# Altium project BMS.PrjPcb
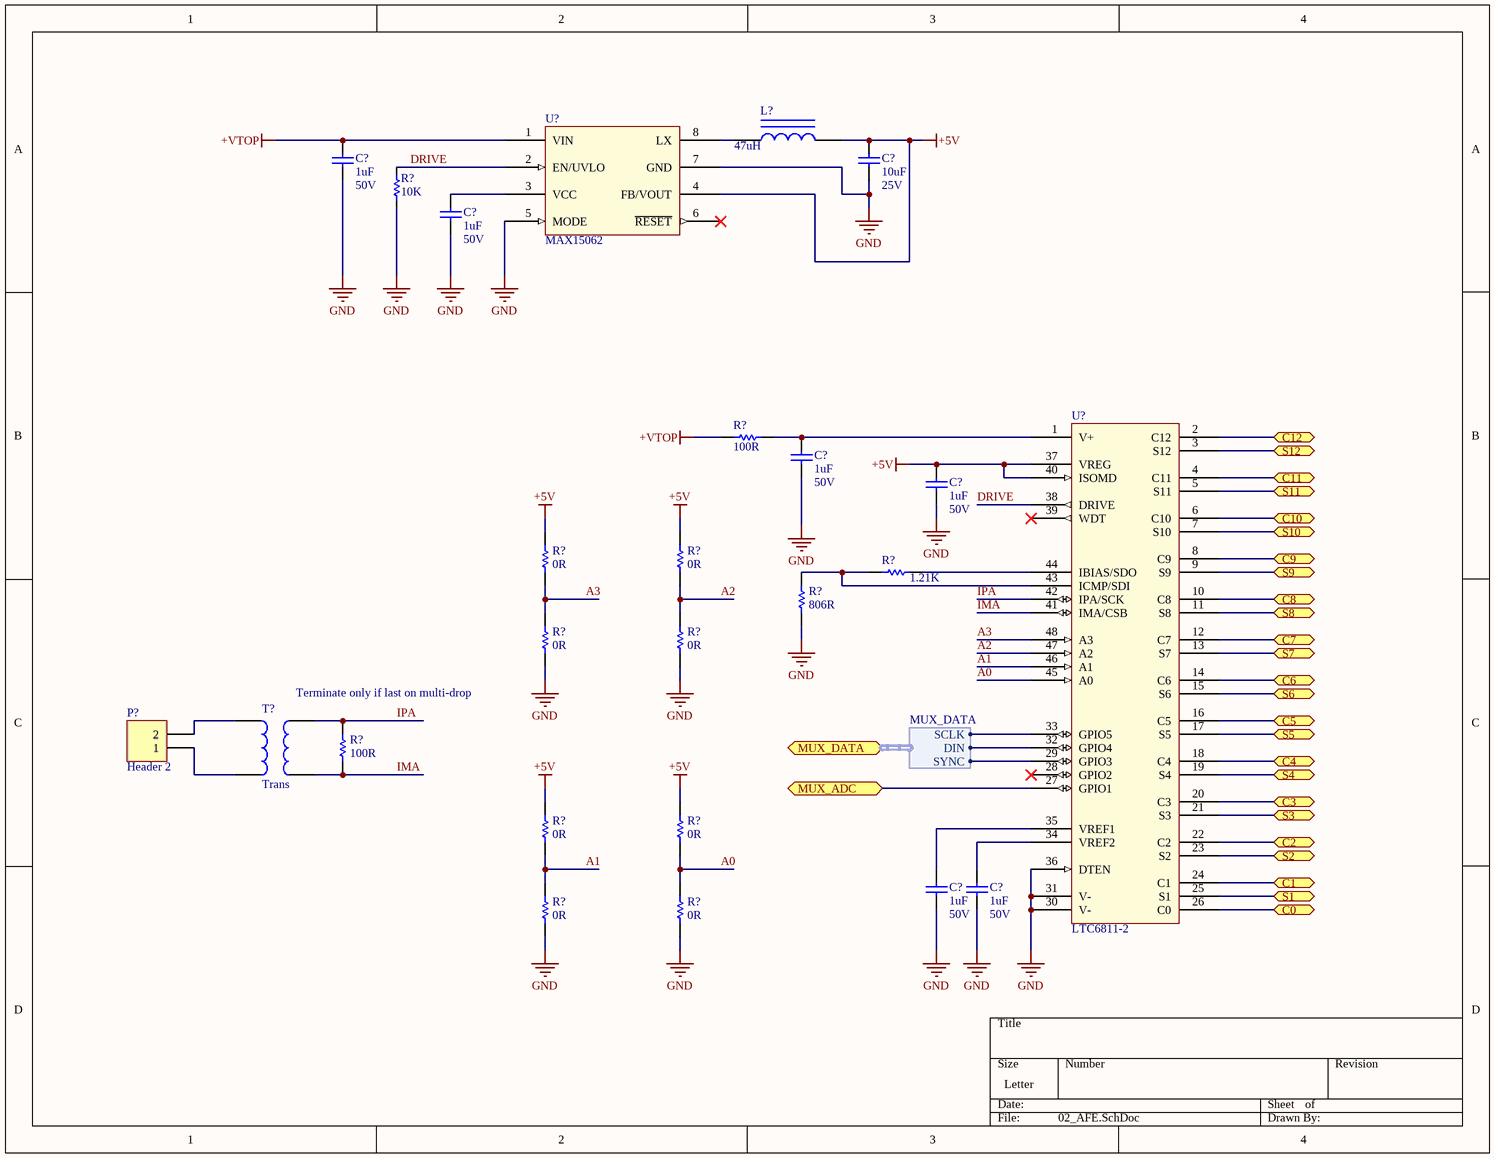
[diagram p0: 02_AFE.SchDoc]
3 sheets, 36 parts. Net scope: flat (ports and power ports of the same name join across sheets).
Sheets:
  01_BlockDiagram.SchDoc
  02_AFE.SchDoc
  04_ThermistorConnection.SchDoc

## Sheet 01_BlockDiagram.SchDoc
size Letter

## Sheet 02_AFE.SchDoc
size Letter

### Parts
(Parts that share a designator on the sheet are numbered #1, #2 ... from top to bottom, then left to right.)
C?#1  1uF  Voltage: 50V  [CAPC1608X06N]
C?#2  10uF  Voltage: 25V  [CAPC1608X06N]
C?#3  1uF  Voltage: 50V  [CAPC1608X06N]
C?#4  1uF  Voltage: 50V  [CAPC1608X06N]
C?#5  1uF  Voltage: 50V  [CAPC1608X06N]
C?#6  1uF  Voltage: 50V  [CAPC1608X06N]
C?#7  1uF  Voltage: 50V  [CAPC1608X06N]
L?  value 47uH  [AXIAL-0.9]  (hidden comment: nductor Iron)
P?  Header 2  [HDR1X2]
R?#1  10K  [0805]
R?#2  value 100R  [AXIAL-0.3]  (hidden comment: Res1)
R?#3  value 0R  [AXIAL-0.3]  (hidden comment: Res1)
R?#4  value 0R  [AXIAL-0.3]  (hidden comment: Res1)
R?#5  value 1.21K  [AXIAL-0.3]  (hidden comment: Res1)
R?#6  value 806R  [AXIAL-0.3]  (hidden comment: Res1)
R?#7  value 0R  [AXIAL-0.3]  (hidden comment: Res1)
R?#8  value 0R  [AXIAL-0.3]  (hidden comment: Res1)
R?#9  value 100R  [AXIAL-0.3]  (hidden comment: Res1)
R?#10  value 0R  [AXIAL-0.3]  (hidden comment: Res1)
R?#11  value 0R  [AXIAL-0.3]  (hidden comment: Res1)
R?#12  value 0R  [AXIAL-0.3]  (hidden comment: Res1)
R?#13  value 0R  [AXIAL-0.3]  (hidden comment: Res1)
T?  Trans  [TRANS]
U?#1  MAX15062
U?#2  LTC6811-2

### Ports
C0, C1, C2, C3, C4, C5, C6, C7, C8, C9, C10, C11, C12, MUX_ADC, MUX_DATA (harness MUX_DATA), S1, S2, S3, S4, S5, S6, S7, S8, S9, S10, S11, S12

### Harnesses
MUX_DATA: SYNC, DIN, SCLK

### Nets
+5V: C?#2.2 C?#5.2 L?.2 R?#3.2 R?#4.2 R?#10.2 R?#11.2 U?#1.4(FB/VOUT) U?#2.37(VREG) U?#2.40(ISOMD)
+VTOP: C?#1.2 R?#2.2 U?#1.1(VIN)
GND: C?#1.1 C?#2.1 C?#3.1 C?#4.1 C?#5.1 C?#6.1 C?#7.1 R?#1.1 R?#6.1 R?#7.1 R?#8.1 R?#12.1 R?#13.1 U?#1.5(MODE) U?#1.7(GND) U?#2.30(V-) U?#2.31(V-) U?#2.36(DTEN)
A0: R?#11.1 R?#13.2 U?#2.45(A0)
A1: R?#10.1 R?#12.2 U?#2.46(A1)
A2: R?#4.1 R?#8.2 U?#2.47(A2)
A3: R?#3.1 R?#7.2 U?#2.48(A3)
DRIVE: R?#1.2 U?#1.2(EN/UVLO) U?#2.38(DRIVE)
IMA: R?#9.1 T?.4 U?#2.41(IMA/CSB)
IPA: R?#9.2 T?.3 U?#2.42(IPA/SCK)
NetC?#3_2: C?#3.2 U?#1.3(VCC)
NetC?#4_2: C?#4.2 R?#2.1 U?#2.1(V+)
NetC?#6_2: C?#6.2 U?#2.35(VREF1)
NetC?#7_2: C?#7.2 U?#2.34(VREF2)
NetC?#11_2: U?#2.27(GPIO1) ; port MUX_ADC
NetL?_1: L?.1 U?#1.8(LX)
NetP?_1: P?.1 T?.2
NetP?_2: P?.2 T?.1
NetR?#5_1: R?#5.1 U?#2.44(IBIAS/SDO)
NetR?#5_2: R?#5.2 R?#6.2 U?#2.43(ICMP/SDI)
NetU?#2_2: U?#2.2(C12) ; port C12
NetU?#2_3: U?#2.3(S12) ; port S12
NetU?#2_4: U?#2.4(C11) ; port C11
NetU?#2_5: U?#2.5(S11) ; port S11
NetU?#2_6: U?#2.6(C10) ; port C10
NetU?#2_7: U?#2.7(S10) ; port S10
NetU?#2_8: U?#2.8(C9) ; port C9
NetU?#2_9: U?#2.9(S9) ; port S9
NetU?#2_10: U?#2.10(C8) ; port C8
NetU?#2_11: U?#2.11(S8) ; port S8
NetU?#2_12: U?#2.12(C7) ; port C7
NetU?#2_13: U?#2.13(S7) ; port S7
NetU?#2_14: U?#2.14(C6) ; port C6
NetU?#2_15: U?#2.15(S6) ; port S6
NetU?#2_16: U?#2.16(C5) ; port C5
NetU?#2_17: U?#2.17(S5) ; port S5
NetU?#2_18: U?#2.18(C4) ; port C4
NetU?#2_19: U?#2.19(S4) ; port S4
NetU?#2_20: U?#2.20(C3) ; port C3
NetU?#2_21: U?#2.21(S3) ; port S3
NetU?#2_22: U?#2.22(C2) ; port C2
NetU?#2_23: U?#2.23(S2) ; port S2
NetU?#2_24: U?#2.24(C1) ; port C1
NetU?#2_25: U?#2.25(S1) ; port S1
NetU?#2_26: U?#2.26(C0) ; port C0
NetU?#2_29: U?#2.29(GPIO3) ; port MUX_DATA.SYNC
NetU?#2_32: U?#2.32(GPIO4) ; port MUX_DATA.DIN
NetU?#2_33: U?#2.33(GPIO5) ; port MUX_DATA.SCLK

Not connected (* = marked no-connect by the designer): U?#1 6(~{RESET})*; U?#2 28(GPIO2)* 39(WDT)*

### Notes on the sheet
- Terminate only if last on multi-drop

### Library data of the parts
C?#1 C?#3-C?#7 = CAP CER 1UF 50V 10% X7R 0603: 1µF ±10% 50V Ceramic Capacitor X7R 0603 (1608 Metric); Manufacturer: Taiyo Yuden; ManufacturerPartNumber: UMK107AB7105KA-T; Value: 1uF; Supplier 1: Digi-Key; Supplier Part Number 1: 587-3247-1-ND
C?#2 = CAP CER 10uF 25V 20% X5R 0603: 10µF ±20% 25V Ceramic Capacitor X5R 0603 (1608 Metric); Manufacturer: Murata Electronics North America; ManufacturerPartNumber: GRM188R61E106MA73D; Value: 10uF; Supplier: Digi-Key; SupplierPartNumber: 490-7202-1-ND
L? = Inductor Iron: Magnetic-Core Inductor; Published: 24-Mar-1999; LatestRevisionDate: 17-Jul-2002; LatestRevisionNote: Re-released for DXP Platform.; PackageReference: AXIAL-0.9; Publisher: Altium Limited; PackageDescription: Axial Device, Thru-Hole; 2 Leads; 0.9 in Pin Spacing
P? = Header 2: Header, 2-Pin; LatestRevisionDate: 17-Jul-2002; LatestRevisionNote: Re-released for DXP Platform.; Publisher: Altium Limited
R?#1 = RES 10K OHM 1/8W 5% 0805 SMD: ManufacturerPartNumber: CRCW080510K0JNEA; Manufacturer: Vishay Dale; Value: 10K; Supplier: Digi-Key; SupplierPartNumber: 541-10KACT-ND; Supplier 1: Digi-Key
R?#2-R?#13 = Res1: Resistor; Published: 8-Jun-2000; LatestRevisionDate: 17-Jul-2002; LatestRevisionNote: Re-released for DXP Platform.; PackageReference: AXIAL-0.3; Publisher: Altium Limited; PackageDescription: Axial Device, Thru-Hole; 2 Leads; 0.3 in Pin Spacing
T? = Trans: Transformer; Published: 24-Mar-1999; LatestRevisionDate: 08-Jul-2005; LatestRevisionNote: Mech Layer 1 removed.; PackageReference: TRANS; Publisher: Altium Limited; PackageDescription: Transformer; 4 Leads
U?#1 = IC_REG_MAX15062: IC REG BUCK 5V 0.3A SYNC 8-TDFN; Manufacturer: Maxim Integrated; Manufacturer Part Number: MAX15062BATA+T; Digikey Part Number: MAX15062BATA+TCT-ND
U?#2 = IC_AFE_LTC6811-2: IC MONITOR BATT STACK 48SSOP; Manufacturer: Linear Technology; Manufacturer Part Number: LTC6811HG-2#PBF; Digikey Part Number: LTC6811HG-2#PBF-ND

## Sheet 04_ThermistorConnection.SchDoc
size Letter
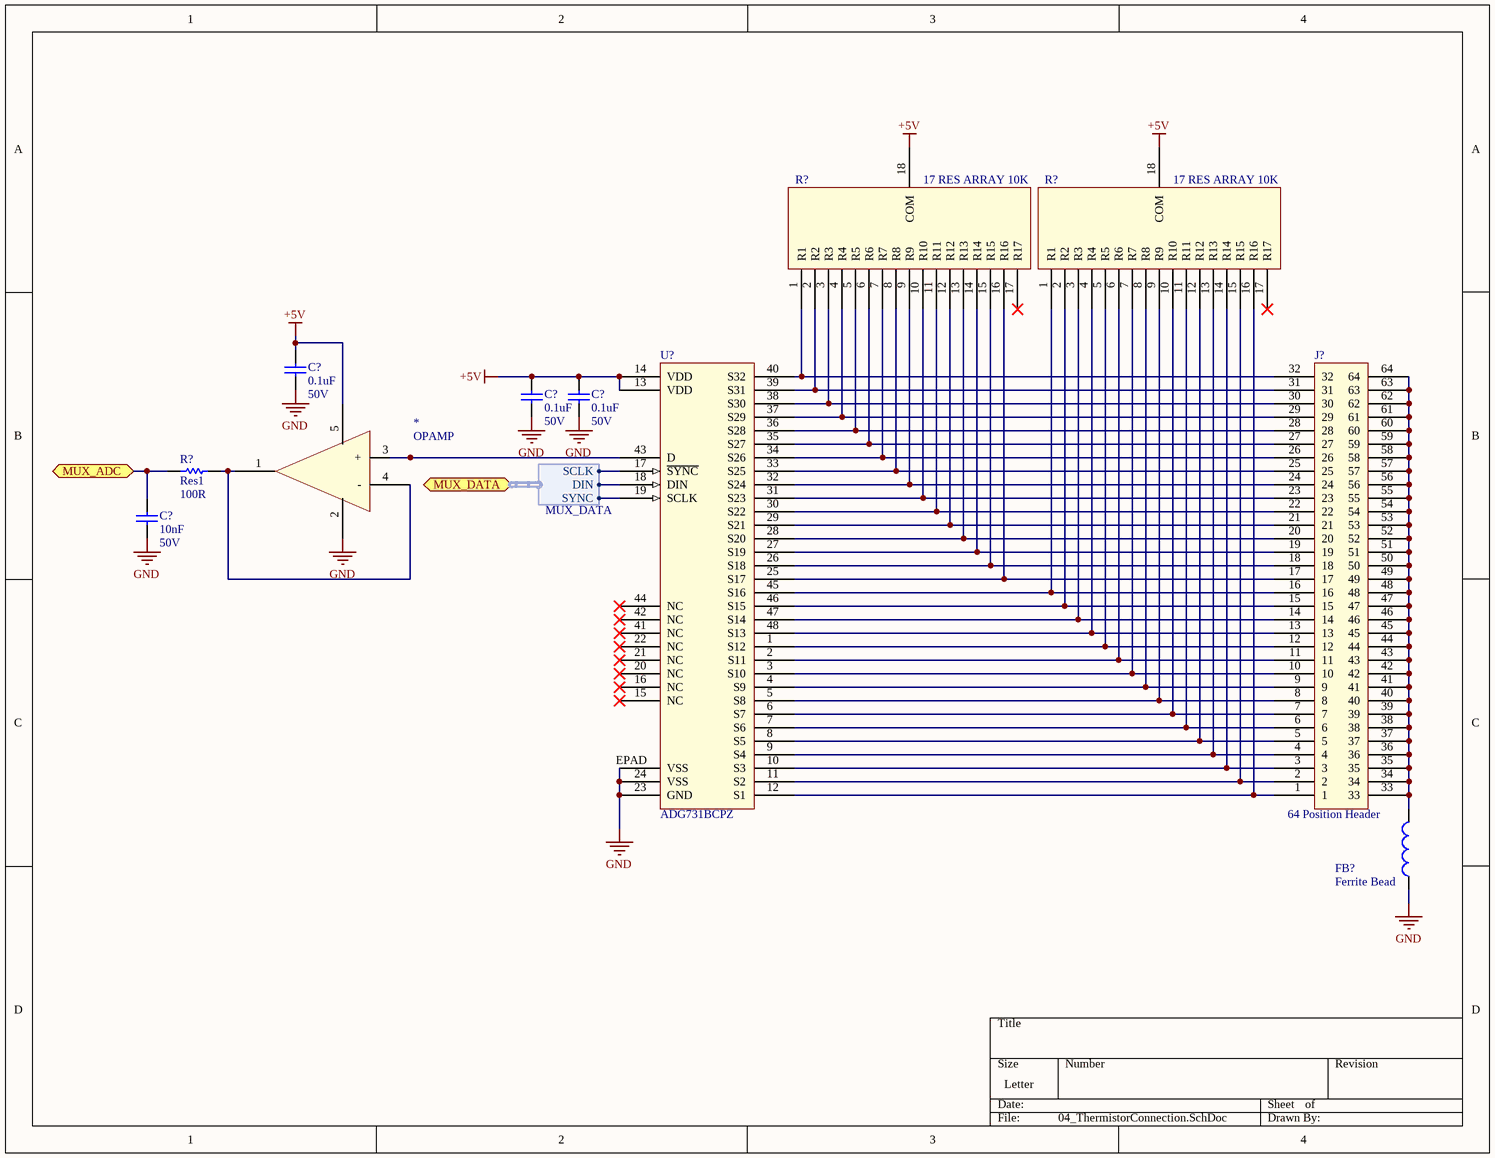
[diagram p1: 04_ThermistorConnection.SchDoc]

### Parts
(Parts that share a designator on the sheet are numbered #1, #2 ... from top to bottom, then left to right.)
*  OPAMP
C?#8  0.1uF  Voltage: 50V  [CAPC1608X06N]
C?#9  0.1uF  Voltage: 50V  [CAPC1608X06N]
C?#10  0.1uF  Voltage: 50V  [CAPC1608X06N]
C?#11  10nF  Voltage: 50V  [CAPC1608X06N]
FB?  Ferrite Bead  [0402-A]
J?  64 Position Header
R?#14  17 RES ARRAY 10K
R?#15  17 RES ARRAY 10K
R?#16  Res1  value 100R  [AXIAL-0.3]
U?#3  ADG731BCPZ

### Ports
MUX_ADC, MUX_DATA (harness MUX_DATA)

### Harnesses
MUX_DATA: SYNC, DIN, SCLK

### Nets
+5V: *.5 C?#8.2 C?#9.2 C?#10.2 R?#14.18(COM) R?#15.18(COM) U?#3.13(VDD) U?#3.14(VDD)
GND: *.2 C?#8.1 C?#9.1 C?#10.1 C?#11.1 FB?.1 U?#3.23(GND) U?#3.24(VSS) U?#3.EPAD(VSS)
Net*_1: *.1 *.4(-) R?#16.2
Net*_3: *.3(+) U?#3.43(D)
NetC?#11_2: C?#11.2 R?#16.1 ; port MUX_ADC
NetFB?_2: FB?.2 J?.33 J?.34 J?.35 J?.36 J?.37 J?.38 J?.39 J?.40 J?.41 J?.42 J?.43 J?.44 J?.45 J?.46 J?.47 J?.48 J?.49 J?.50 J?.51 J?.52 J?.53 J?.54 J?.55 J?.56 J?.57 J?.58 J?.59 J?.60 J?.61 J?.62 J?.63 J?.64
NetJ?_1: J?.1 R?#15.16(R16) U?#3.12(S1)
NetJ?_2: J?.2 R?#15.15(R15) U?#3.11(S2)
NetJ?_3: J?.3 R?#15.14(R14) U?#3.10(S3)
NetJ?_4: J?.4 R?#15.13(R13) U?#3.9(S4)
NetJ?_5: J?.5 R?#15.12(R12) U?#3.8(S5)
NetJ?_6: J?.6 R?#15.11(R11) U?#3.7(S6)
NetJ?_7: J?.7 R?#15.10(R10) U?#3.6(S7)
NetJ?_8: J?.8 R?#15.9(R9) U?#3.5(S8)
NetJ?_9: J?.9 R?#15.8(R8) U?#3.4(S9)
NetJ?_10: J?.10 R?#15.7(R7) U?#3.3(S10)
NetJ?_11: J?.11 R?#15.6(R6) U?#3.2(S11)
NetJ?_12: J?.12 R?#15.5(R5) U?#3.1(S12)
NetJ?_13: J?.13 R?#15.4(R4) U?#3.48(S13)
NetJ?_14: J?.14 R?#15.3(R3) U?#3.47(S14)
NetJ?_15: J?.15 R?#15.2(R2) U?#3.46(S15)
NetJ?_16: J?.16 R?#15.1(R1) U?#3.45(S16)
NetJ?_17: J?.17 R?#14.16(R16) U?#3.25(S17)
NetJ?_18: J?.18 R?#14.15(R15) U?#3.26(S18)
NetJ?_19: J?.19 R?#14.14(R14) U?#3.27(S19)
NetJ?_20: J?.20 R?#14.13(R13) U?#3.28(S20)
NetJ?_21: J?.21 R?#14.12(R12) U?#3.29(S21)
NetJ?_22: J?.22 R?#14.11(R11) U?#3.30(S22)
NetJ?_23: J?.23 R?#14.10(R10) U?#3.31(S23)
NetJ?_24: J?.24 R?#14.9(R9) U?#3.32(S24)
NetJ?_25: J?.25 R?#14.8(R8) U?#3.33(S25)
NetJ?_26: J?.26 R?#14.7(R7) U?#3.34(S26)
NetJ?_27: J?.27 R?#14.6(R6) U?#3.35(S27)
NetJ?_28: J?.28 R?#14.5(R5) U?#3.36(S28)
NetJ?_29: J?.29 R?#14.4(R4) U?#3.37(S29)
NetJ?_30: J?.30 R?#14.3(R3) U?#3.38(S30)
NetJ?_31: J?.31 R?#14.2(R2) U?#3.39(S31)
NetJ?_32: J?.32 R?#14.1(R1) U?#3.40(S32)
NetU?#2_29: U?#3.19(SCLK) ; port MUX_DATA.SYNC
NetU?#2_32: U?#3.18(DIN) ; port MUX_DATA.DIN
NetU?#2_33: U?#3.17(~{SYNC}) ; port MUX_DATA.SCLK

Not connected (* = marked no-connect by the designer): R?#14 17(R17)*; R?#15 17(R17)*; U?#3 15(NC)* 16(NC)* 20(NC)* 21(NC)* 22(NC)* 41(NC)* 42(NC)* 44(NC)*

### Library data of the parts
C?#8-C?#10 = CAP CER 0.1UF 50V 10% X7R 0603: 0.10µF ±10% 50V Ceramic Capacitor X7R 0603 (1608 Metric); Manufacturer: AVX Corporation; ManufacturerPartNumber: 06035C104KAT2A; Value: 0.1uF; Supplier: Digi-Key; SupplierPartNumber: 478-5052-1-ND
C?#11 = CAP CER 10nF 50V 5% X7R 0603: 10000pF ±5% 50V Ceramic Capacitor U2J 0603 (1608 Metric); Manufacturer: Kemet; ManufacturerPartNumber: C0603C103J5JAC7867; Value: 10nF; Supplier: Digi-Key; SupplierPartNumber: 399-13384-1-ND
FB? = Inductor: Code_IEC: 1005; Published: 8-Jun-2000; LatestRevisionDate: 29-May-2009; LatestRevisionNote: IPC-7351 Footprint Added.; PackageReference: 0402-A; Publisher: Altium Limited; PackageDescription: Chip Inductor; Code_JEITA: 0402
J? = 64 Position Header (Temporary)
R?#16 = Res1: Resistor; Published: 8-Jun-2000; LatestRevisionDate: 17-Jul-2002; LatestRevisionNote: Re-released for DXP Platform.; PackageReference: AXIAL-0.3; Publisher: Altium Limited; PackageDescription: Axial Device, Thru-Hole; 2 Leads; 0.3 in Pin Spacing
U?#3 = IC_MUX_ADG731BCPZ: IC MULTIPLEXER 32X1 48LFCSP; Manufacturer: Analog Devices Inc.; Supplier 1: Digi-Key; Supplier Part Number 1: ADG731BCPZ-ND; Manufacturer Part Number: ADG731BCPZ

## Nets that join several sheets
+5V: 02_AFE (10 pins), 04_ThermistorConnection (8 pins)
GND: 02_AFE (18 pins), 04_ThermistorConnection (9 pins)
NetC?#11_2: 02_AFE (U?#2.27), 04_ThermistorConnection (C?#11.2 R?#16.1)
NetU?#2_29: 02_AFE (U?#2.29), 04_ThermistorConnection (U?#3.19)
NetU?#2_32: 02_AFE (U?#2.32), 04_ThermistorConnection (U?#3.18)
NetU?#2_33: 02_AFE (U?#2.33), 04_ThermistorConnection (U?#3.17)